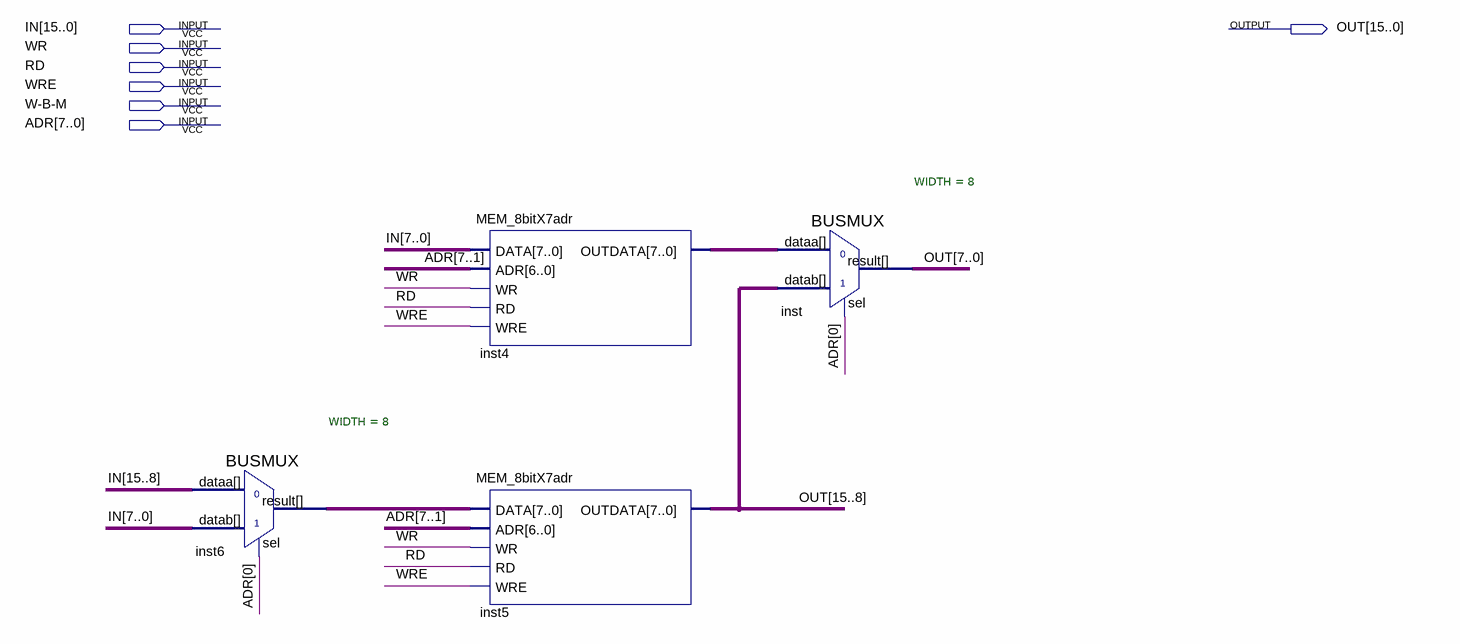
[diagram p0: schematic sheet]
// Quartus schematic MEM_16bitX8adr_eq8bitX8adr_shift.bdf as structural Verilog: 4 symbols, 7 pins
module MEM_16bitX8adr_eq8bitX8adr_shift (
  input  [15:0] IN,
  input  WR,
  input  RD,
  input  WRE,
  input  \W-B-M ,
  input  [7:0] ADR,
  output [15:0] OUT
);

  wire [7:0] inst4_outdata, inst6_result;

  BUSMUX #(.WIDTH(8)) inst6 (.datab(IN[7:0]), .sel(ADR[0]), .dataa(IN[15:8]), .result(inst6_result));
  MEM_8bitX7adr inst4 (.DATA(IN[7:0]), .ADR(ADR[7:1]), .WR(WR), .RD(RD), .WRE(WRE), .OUTDATA(inst4_outdata));
  MEM_8bitX7adr inst5 (.DATA(inst6_result), .ADR(ADR[7:1]), .WR(WR), .RD(RD), .WRE(WRE), .OUTDATA(OUT[15:8]));
  BUSMUX #(.WIDTH(8)) inst (.datab(OUT[15:8]), .sel(ADR[0]), .dataa(inst4_outdata), .result(OUT[7:0]));
endmodule
